# EAGLE design temp_sens_ring (EAGLE 9.6.2)
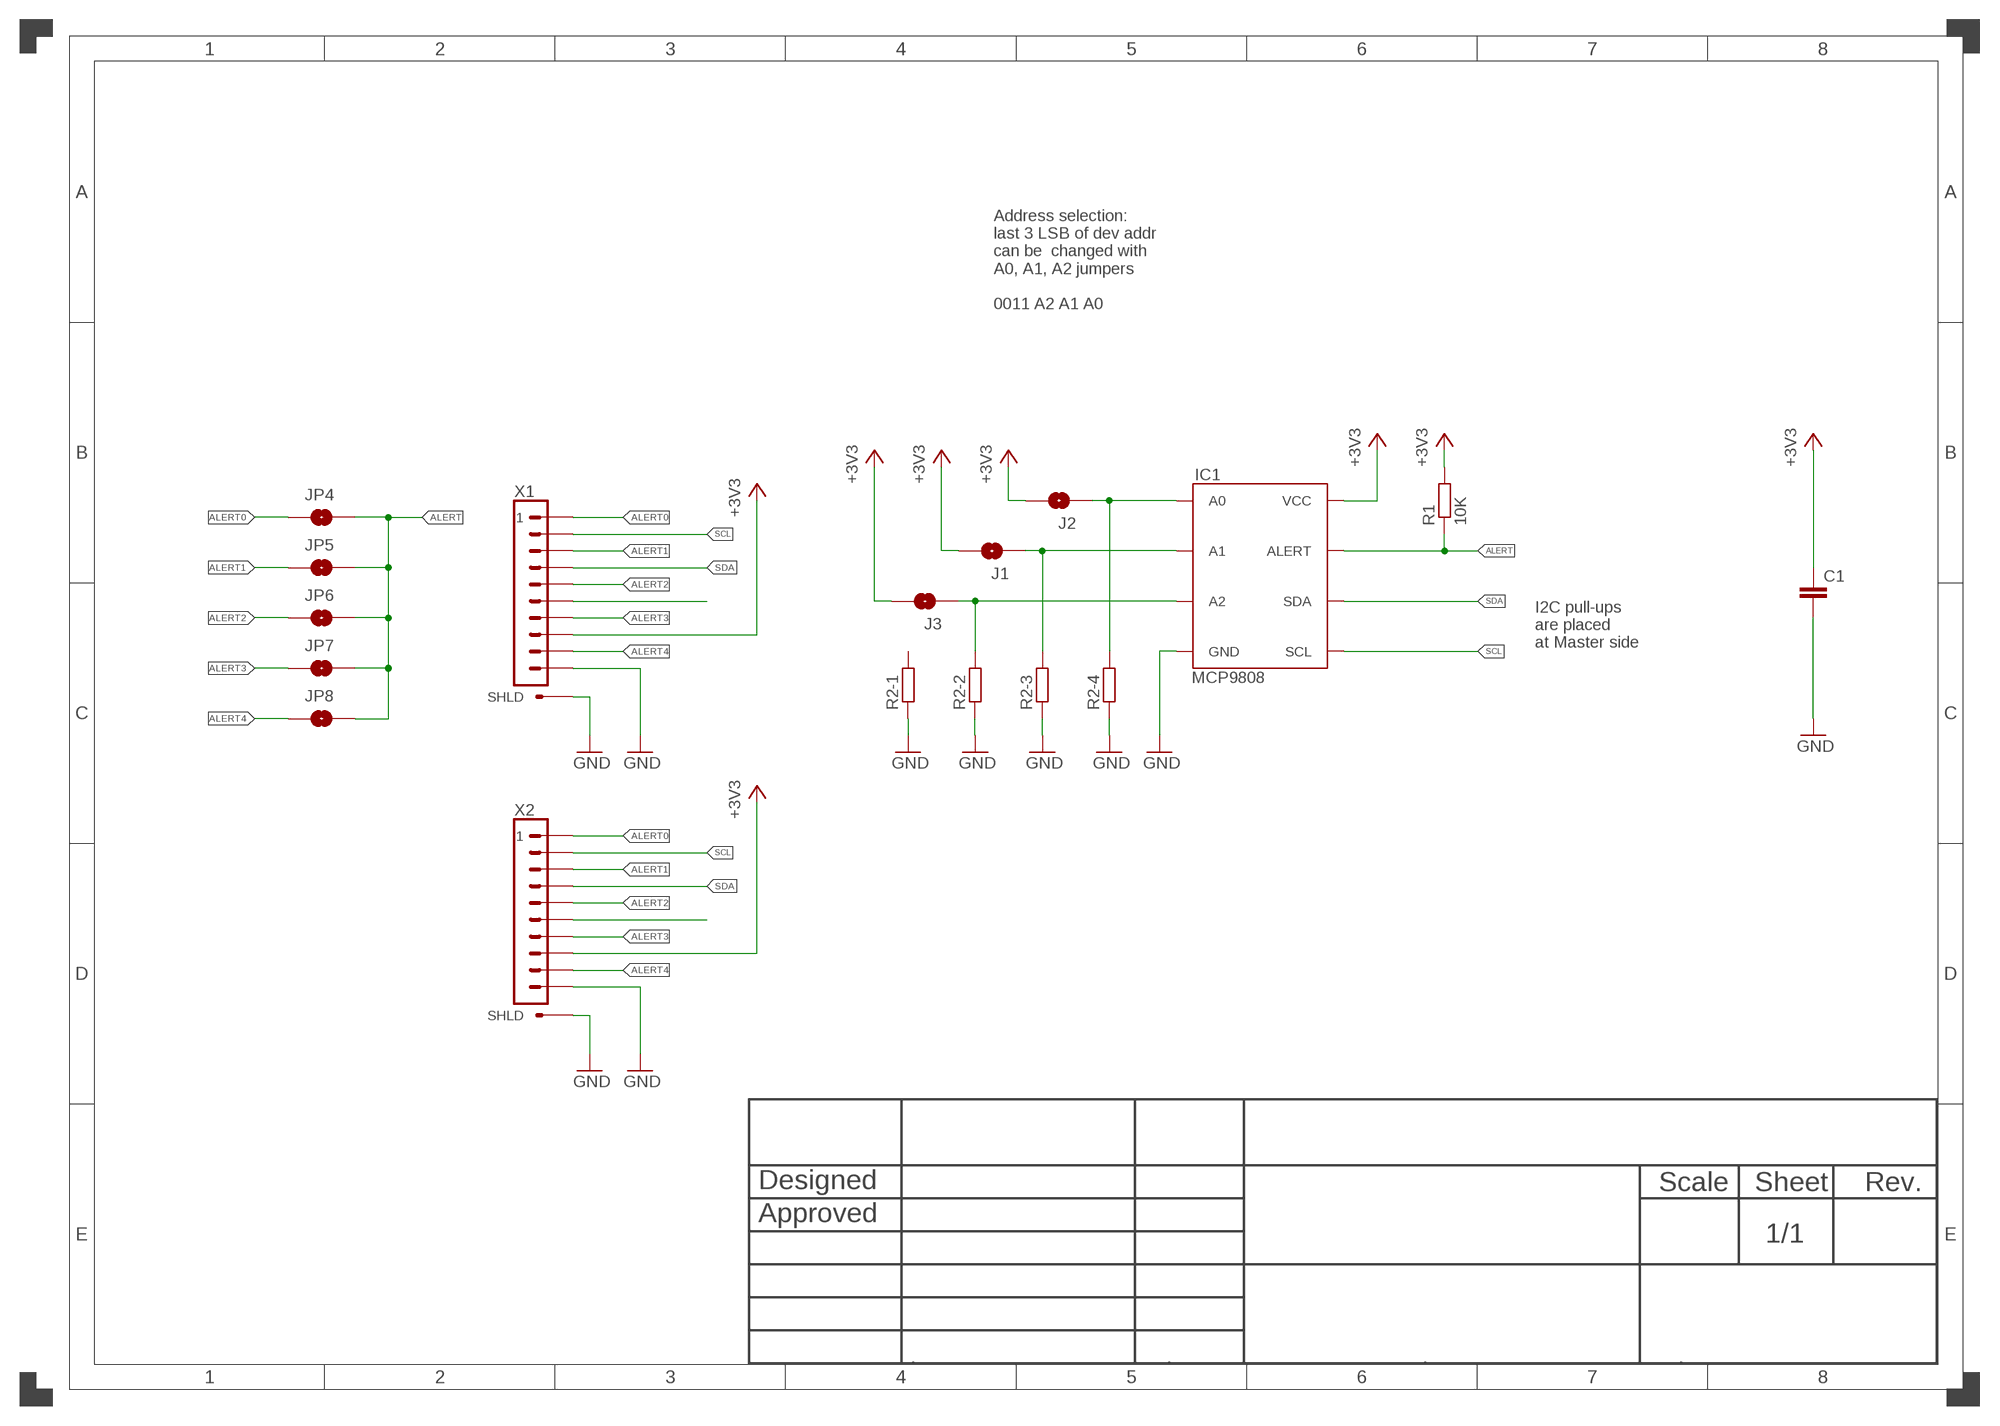
[diagram p0: schematic, sheet 1]

## Parts
C1  CAP_CERAMIC_0402  [C0402]
IC1  MCP9808  [MSOP-8]
J1  SMD_JUMP_2_NO_S  [SMT_JUMP_2_NO_SMALL]
J2  SMD_JUMP_2_NO_S  [SMT_JUMP_2_NO_SMALL]
J3  SMD_JUMP_2_NO_S  [SMT_JUMP_2_NO_SMALL]
JP4  AL0  JUMPER-SMT_2_NO_NO-SILK  [SMT-JUMPER_2_NO_NO-SILK]
JP5  AL1  JUMPER-SMT_2_NO_NO-SILK  [SMT-JUMPER_2_NO_NO-SILK]
JP6  AL2  JUMPER-SMT_2_NO_NO-SILK  [SMT-JUMPER_2_NO_NO-SILK]
JP7  AL3  JUMPER-SMT_2_NO_NO-SILK  [SMT-JUMPER_2_NO_NO-SILK]
JP8  AL4  JUMPER-SMT_2_NO_NO-SILK  [SMT-JUMPER_2_NO_NO-SILK]
R1  10K  RESISTOR_0402  [0402]
R2  RESISTOR_NET_4-0502  [R0502_4X]
X1  FFC_10PV  [FFC_1X10_VERTICAL]
X2  FFC_10PV  [FFC_1X10_VERTICAL]

## Nets
+3V3: C1.1 IC1.P$8(VCC) J1.2 J2.2 J3.2 R1.2 X1.P$8 X2.P$8
ALERT: IC1.P$3(ALERT) JP4.2 JP5.2 JP6.2 JP7.2 JP8.2 R1.1
ALERT0: JP4.1 X1.P$1 X2.P$1
ALERT1: JP5.1 X1.P$3 X2.P$3
ALERT2: JP6.1 X1.P$5 X2.P$5
ALERT3: JP7.1 X1.P$7 X2.P$7
ALERT4: JP8.1 X1.P$9 X2.P$9
GND: C1.2 IC1.P$4(GND) R2.P$1 R2.P$2 R2.P$3 R2.P$4 X1.P$10 X1.P$11(SHLD) X1.P$12(SHLD) X2.P$10 X2.P$11(SHLD) X2.P$12(SHLD)
N$1: IC1.P$5(A2) J3.1 R2.P$7
N$2: IC1.P$6(A1) J1.1 R2.P$6
N$3: IC1.P$7(A0) J2.1 R2.P$5
N$6: X2.P$6
N$14: X1.P$6
SCL: IC1.P$2(SCL) X1.P$2 X2.P$2
SDA: IC1.P$1(SDA) X1.P$4 X2.P$4
Unconnected: R2.P$8

## Notes on the sheet
- Address selection:
  last 3 LSB of dev addr
  can be  changed with 
  A0, A1, A2 jumpers
  
  0011 A2 A1 A0
- I2C pull-ups
  are placed
  at Master side

## Library data of the parts
C1 = temp_sens_ring:CAP_CERAMIC_*
IC1 = temp_sens_ring:MCP9808
J1-J3 = temp_sens_ring:SMD_JUMP_2_NO_
JP4-JP8 = temp_sens_ring:JUMPER-SMT_2_NO: Normally open jumper This jumper has two pads in close proximity to each other. Apply solder to close the connection. Round pads are easier to solder for beginners, but are a lot larger. SparkFun Product that uses the round pads: SparkFun EL Sequencer <https://www.sparkfun.com/products/12781>
R1 = temp_sens_ring:RESISTOR_*
R2 = temp_sens_ring:RESISTOR_NET_*
X1 X2 = temp_sens_ring:FFC_10P; MFR: XFCN; MFR_PART: F1002-B-10-20T-R; PITCH: 1.00

## Board
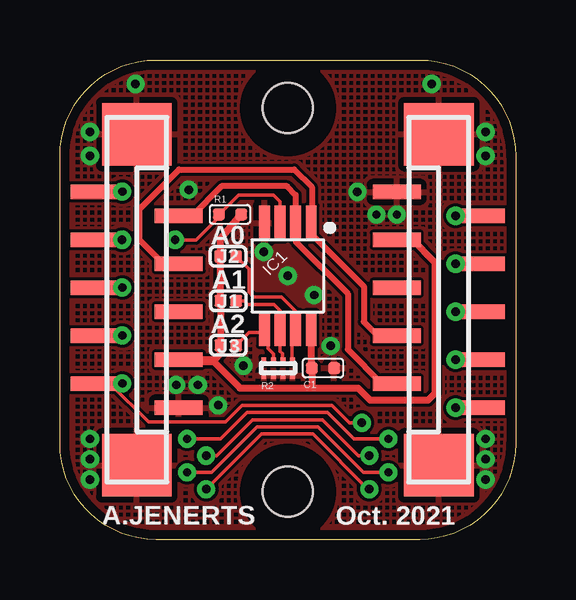
[diagram p1: board, top side]
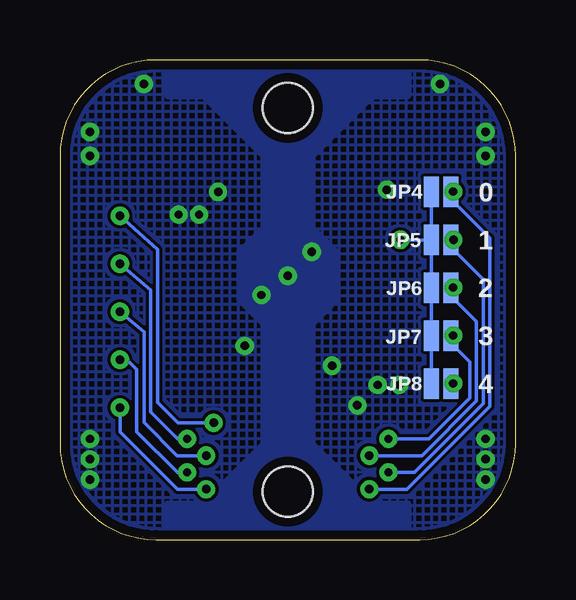
[diagram p2: board, bottom side, seen from below]

Size 19 x 20 mm. Coordinates in mm from the lower left corner, seen from the top.
Outline: 0,4 0,16 arc-90 4,20 15,20 arc-90 19,16 19,4 arc-90 15,0 4,0 arc-90 0,4
Copper layers (1*16): Top 0.035mm / dielectric 0.8mm / Bottom 0.035mm
Design rules "2layer_JLCPCB_2021_02 *": minimum track width 5mil, minimum drill 0.2mm, track to track 5mil, track to pad 0.2mm, pad to pad 5mil, via to via 0.2mm, smd to smd 0mil, copper to edge 0.4mm, drill to drill 10mil, minimum pad ring 3mil, minimum via ring 8mil, stop-mask expansion 4mil, vias tented up to drill 0.35mm, thermal gap 10mil
Holes 2.1 mm at 9.5,18 9.5,2
tRestrict: area 7.6,16.1 to 11.4,19.9; area 7.6,0.1 to 11.4,3.9
bRestrict: area 8.4,0.9 to 10.6,3; area 8.4,16.9 to 10.6,19.1

### Footprints (pad centres in the part's own frame; a part is rotated, then mirrored left to right if it is on the bottom)
C0402 = smd 0.5 x 0.5: 1 0,0.463; 2 0,-0.463
MSOP-8 = smd 0.45 x 1.45: P$1 -0.975,-2.2; P$2 -0.325,-2.2; P$3 0.325,-2.2; P$4 0.975,-2.2; P$5 0.975,2.2; P$6 0.325,2.2; P$7 -0.325,2.2; P$8 -0.975,2.2
SMT_JUMP_2_NO_SMALL = smd 0.5 x 0.5: 1 -0.331,0; 2 0.331,0
SMT-JUMPER_2_NO_NO-SILK = smd 0.635 x 1.27: 1 -0.406,0; 2 0.406,0
0402 = smd 0.5 x 0.5: 1 0,0.463; 2 0,-0.463
R0502_4X = smd 0.2 x 0.3: P$1 -0.6,-0.3; P$2 -0.2,-0.3; P$3 0.2,-0.3; P$4 0.6,-0.3; P$5 0.6,0.3; P$6 0.2,0.3; P$7 -0.2,0.3; P$8 -0.6,0.3
FFC_1X10_VERTICAL = smd 0.6 x 2: P$1 -4.5,-1.75; P$2 -3.5,1.75; P$3 -2.5,-1.75; P$4 -1.5,1.75; P$5 -0.5,-1.75; P$6 0.5,1.75; P$7 1.5,-1.75; P$8 2.5,1.75; P$9 3.5,-1.75; P$10 4.5,1.75 | smd 2.6 x 2.9: P$11 -6.9,0; P$12 6.9,0

### Placement (x,y rotation side)
C1  10.97,7.15 90 top
IC1  9.5,11 180 top
J1  7.02,9.95 180 top
J2  7.01,11.81 180 top
J3  7.02,8.1 180 top
JP4  3.1,14.5 180 bottom
JP5  3.1,12.5 180 bottom
JP6  3.1,10.5 180 bottom
JP7  3.1,8.5 180 bottom
JP8  3.1,6.5 180 bottom
R1  7.09,13.56 90 top
R2  9.1,7.15 0 top
X1  3.2,10 270 top
X2  15.8,10 90 top

### Tracks (layer width: path | path; a pad name or v marks a point on that pad's centre or on a via)
+3V3
  Top 0.3: R1.2 6.68,12.51 J2.2 J1.2 J3.2 6.7,7.76 6.44,7.5 X1.P$8 5.05,7.4 6.42,7.4 7.5,6.32 10.5,6.32 | 10.48,7.12 C1.1 | IC1.P$8 10.47,7.18 C1.1 | X2.P$8 14.08,12.53 14.67,12.53 15.66,11.54 15.66,6.12 15.36,5.82 12.93,5.82 12.43,6.32 10.5,6.32 | C1.1 10.51,6.33 10.5,6.32
ALERT  (via drill 0.35)
  Top 0.15: IC1.P$3 9.18,14.1 8.9,14.37 7.44,14.37 R1.1 6.63,13.45 5.68,12.5 v4.8,12.5
  Bottom 0.15: JP4.2 JP5.2 | JP5.2 JP6.2 JP7.2 JP8.2 | v4.8,12.5 JP5.2
ALERT0  (via drill 0.35)
  Top 0.15: v16.5,5.5 X2.P$1 | v6.1,2.1 8.4,4.4 10.55,4.4 12.85,2.1 v12.9,2.1
  Top 0.3: X1.P$1 v2.6,14.51
  Bottom 0.15: JP4.1 2.69,14.2 1.07,12.58 1.07,5.56 4.53,2.1 v6.1,2.1 | v12.9,2.1 14.1,2.1 16.5,4.5 v16.5,5.5
  Bottom 0.3: JP4.1 v2.61,14.5 v2.6,14.51
ALERT1  (via drill 0.35)
  Top 0.15: v16.5,7.5 X2.P$3 | v5.3,2.8 6.32,2.8 8.22,4.7 10.75,4.7 12.65,2.8 v13.7,2.8
  Top 0.3: X1.P$3 v2.59,12.5
  Bottom 0.15: JP5.1 2.69,12.19 1.35,10.85 1.35,5.67 4.22,2.8 v5.3,2.8 | v16.5,7.5 16.2,7.5 15.8,7.1 15.8,4.5 14.1,2.8 v13.7,2.8
  Bottom 0.3: v2.59,12.5 JP5.1
ALERT2  (via drill 0.35)
  Top 0.15: v16.5,9.5 X2.P$5 | v6.1,3.5 6.53,3.5 8.03,5 10.96,5 12.46,3.5 v12.9,3.5
  Top 0.3: v2.6,10.51 X1.P$5
  Bottom 0.15: JP6.1 2.69,10.16 1.63,9.1 1.63,5.79 3.91,3.5 v6.1,3.5 | v16.5,9.5 15.5,8.67 15.5,4.88 14.12,3.5 v12.9,3.5
  Bottom 0.3: JP6.1 2.61,10.5 v2.6,10.51
ALERT3  (via drill 0.35)
  Top 0.15: v16.5,11.5 X2.P$7 | v5.3,4.2 6.7,4.2 7.8,5.3 11.15,5.3 12.25,4.2 v13.7,4.2
  Top 0.3: v2.6,8.51 X1.P$7
  Bottom 0.15: JP7.1 2.69,8.19 1.91,7.4 1.91,5.9 3.61,4.2 v5.3,4.2 | v16.5,11.5 15.22,10.4 15.22,5.32 14.1,4.2 v13.7,4.2
  Bottom 0.3: JP7.1 2.61,8.5 v2.6,8.51
ALERT4  (via drill 0.35)
  Top 0.15: v16.5,13.5 X2.P$9 | X1.P$9 2.1,6.5 3.7,4.9 6.9,4.9 7.6,5.6 11.35,5.6 12.08,4.87 v12.59,4.87
  Top 0.3: X1.P$9 v2.6,6.51
  Bottom 0.15: v16.5,13.5 14.92,12.1 14.92,5.72 14.07,4.87 v12.59,4.87
  Bottom 0.3: JP8.1 2.61,6.5 v2.6,6.51
GND  (via drill 0.35)
  other vias: 9.5,11 10.6,10.2 8.5,12 1.25,2.5 1.25,3.35 1.25,4.2 17.75,3.35 17.75,4.2 17.75,2.5 17.75,17 17.75,16 15.5,19 1.25,16 3.15,19 1.25,17 7.65,7.25 5.37,14.59 11.29,8.08 4.85,6.45 5.75,6.45 14.05,13.55 6.6,5.6 12.4,14.5 13.2,13.55
  pour Top (rank 5, hatched): -1,-1 -1,21 20,21 20,-1
  pour Top (rank 4): 8.1,12.5 8.1,9.6 10.9,9.6 10.9,12.5
  pour Bottom (rank 5, hatched): -1,21 -1,-1 20,-1 20,21
  pour Bottom (rank 4): 4.5,20 4.5,18.5 6,18.5 8.5,16 8.5,13 7.5,12 7.5,10 8.5,9 8.5,4 5.95,1.5 4.5,1.5 4.5,0 14.5,0 14.5,1.5 13,1.5 10.5,4 10.5,9 11.5,10 11.5,12 10.5,13 10.5,16 13,18.5 14.5,18.5 14.5,20
N$1
  Top 0.15: J3.1 7.88,8.63 8.36,8.63 | 8.36,8.63 IC1.P$5 | 8.36,8.63 8.68,8.31 8.68,7.96 8.9,7.74 R2.P$7
N$2
  Top 0.15: J1.1 7.67,9.95 7.81,9.81 8.92,9.81 9.19,9.55 IC1.P$6 9.18,7.85 9.28,7.75 9.28,7.47 R2.P$6
N$3
  Top 0.15: J2.1 7.88,11.27 7.88,10.32 8.08,10.12 9.23,10.12 9.82,9.53 IC1.P$7 9.82,8.48 9.68,8.34 9.68,7.47 R2.P$5
SCL
  Top 0.25: X1.P$2 5.5,13.5 6.73,14.73 9.47,14.73 9.82,14.38 IC1.P$2 9.82,12.44 12,10.26 12,7.93 13.43,6.5 X2.P$2
SDA
  Top 0.25: X1.P$4 4.31,11.5 3.31,12.5 3.31,13.78 4.96,15.43 9.77,15.43 10.5,14.7 10.5,13.22 IC1.P$1 10.47,12.76 12.67,10.56 12.67,9.08 13.25,8.5 X2.P$4

### Text on the board
_tsilk: A0 | A1 | A2 | A.JENERTS | Oct. 2021
_bsilk: 0 | 1 | 2 | 3 | 4